# EAGLE design MAX-M8Q GPS FeatherWing (EAGLE 8.3.2)
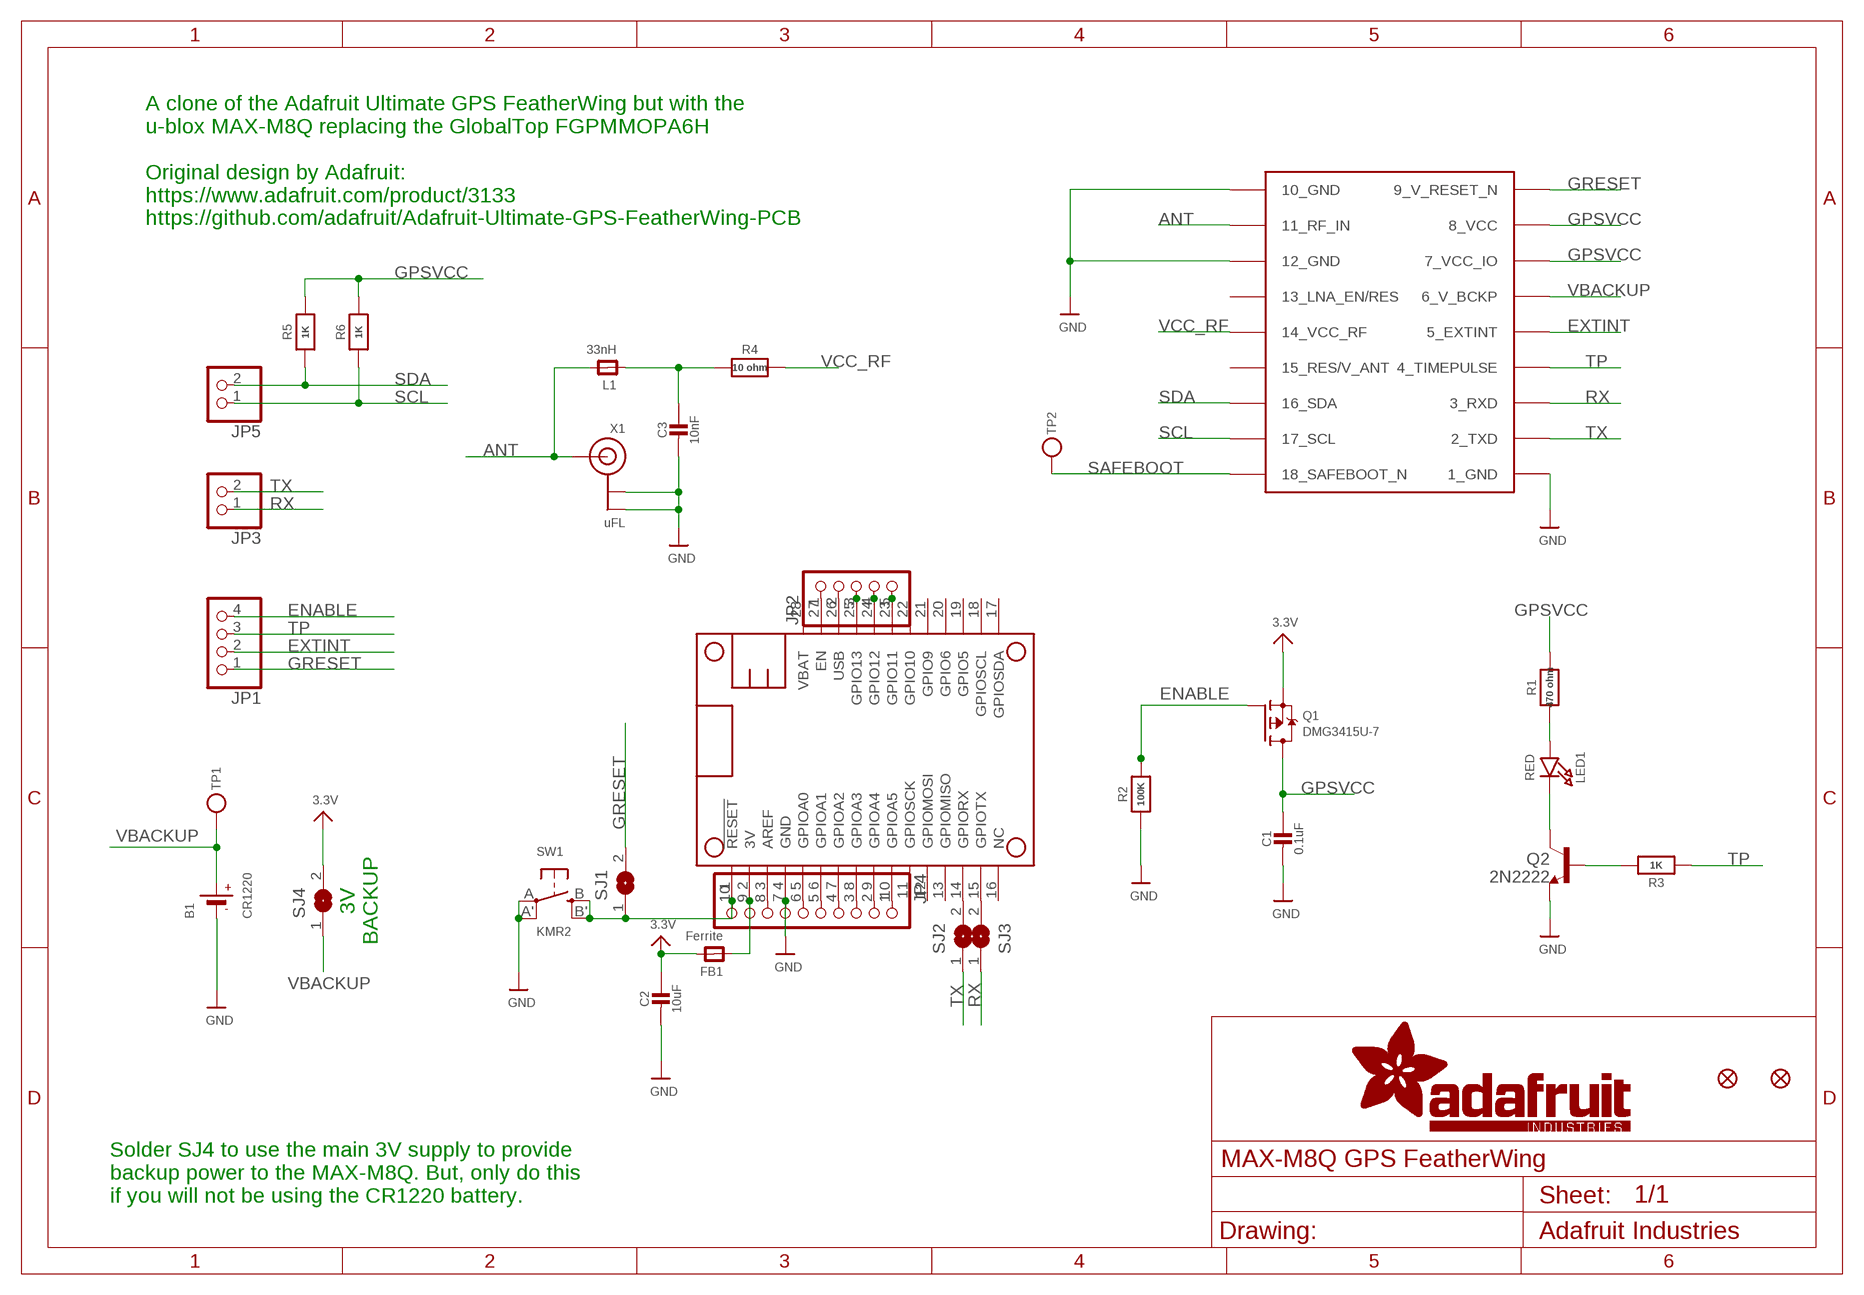
[diagram p0: schematic, sheet 1]

## Parts
B1  CR1220  BATTERYCR1220_2  [CR1220-2]
C1  0.1uF  CAP_CERAMIC0805-NOOUTLINE  [0805-NO]
C2  10uF  CAP_CERAMIC0805-NOOUTLINE  [0805-NO]
C3  10nF  CAP_CERAMIC0805-NOOUTLINE  [0805-NO]
FB1  Ferrite  FERRITE-0805NO  [0805-NO]
FID1  FIDUCIAL""  [FIDUCIAL_1MM]
FID2  FIDUCIAL""  [FIDUCIAL_1MM]
JP1  HEADER-1X4ROUND  [1X04_ROUND]
JP2  HEADER-1X570MIL  [1X05_ROUND_70]
JP3  HEADER-1X2ROUND  [1X02_ROUND]
JP4  HEADER-1X10ROUND  [1X10_ROUND]
JP5  HEADER-1X2ROUND  [1X02_ROUND]
L1  33nH  FERRITE-0805NO  [0805-NO]
LED1  RED  LED0805_NOOUTLINE  [CHIPLED_0805_NOOUTLINE]
MS1  FEATHERWING  [FEATHERWING]
Q1  DMG3415U-7  MOSFET-PWIDE  [SOT23-WIDE]
Q2  2N2222  MMBT2222ALT1-NPN-SOT23-BEC  [SOT23-BEC]
R1  470 ohm  RESISTOR0805_NOOUTLINE  [0805-NO]
R2  100K  RESISTOR0805_NOOUTLINE  [0805-NO]
R3  1K  RESISTOR0805_NOOUTLINE  [0805-NO]
R4  10 ohm  RESISTOR0805_NOOUTLINE  [0805-NO]
R5  1K  RESISTOR0805_NOOUTLINE  [0805-NO]
R6  1K  RESISTOR0805_NOOUTLINE  [0805-NO]
SJ1  SOLDERJUMPER  [SOLDERJUMPER_ARROW_NOPASTE]
SJ2  SOLDERJUMPERCLOSED  [SOLDERJUMPER_CLOSEDWIRE]
SJ3  SOLDERJUMPERCLOSED  [SOLDERJUMPER_CLOSEDWIRE]
SJ4  SOLDERJUMPER  [SOLDERJUMPER_ARROW_NOPASTE]
SW1  KMR2  SWITCH_TACT_SMT4.6X2.8  [BTN_KMR2_4.6X2.8]
TP1  TESTPOINTROUND1.5MM  [TESTPOINT_ROUND_1.5MM]
TP2  TESTPOINTROUND1.5MM  [TESTPOINT_ROUND_1.5MM]
U1  MAX-M8  [MAX-M8]
X1  uFL  ANTENNA_U.FL  [U.FL]

## Nets
3.3V: C2.1 FB1.2 Q1.2(S) SJ4.2
3V: FB1.1 JP4.9 MS1.2(3V)
ANT: L1.2 U1.11_RF_IN X1.3(SIGNAL)
ENABLE: JP1.4 Q1.1(G) R2.2
EXTINT: JP1.2 U1.5_EXTINT
GND: B1.- C1.2 C2.2 C3.2 JP4.7 MS1.4(GND) Q2.E R2.1 SW1.A'(P1) SW1.A(P) U1.1_GND U1.10_GND U1.12_GND X1.1(GND) X1.2(GND)
GPSVCC: C1.1 Q1.3(D) R1.2 R5.2 R6.2 U1.7_VCC_IO U1.8_VCC
GRESET: JP1.1 SJ1.2 U1.9_RESET_N(9_V_RESET_N)
N$1: JP2.3 MS1.25(GPIO13)
N$2: LED1.A R1.1
N$3: JP2.4 MS1.24(GPIO12)
N$4: C3.1 L1.1 R4.1
N$5: JP2.5 MS1.23(GPIO11)
N$6: JP4.1 MS1.10(GPIOA5)
N$7: JP4.2 MS1.9(GPIOA4)
N$8: JP4.3 MS1.8(GPIOA3)
N$9: JP4.4 MS1.7(GPIOA2)
N$10: JP4.5 MS1.6(GPIOA1)
N$11: JP4.6 MS1.5(GPIOA0)
N$12: JP4.10 MS1.1(!RESET) SJ1.1 SW1.B'(S1) SW1.B(S)
N$13: JP4.8 MS1.3(AREF)
N$14: JP2.1 MS1.27(EN)
N$16: MS1.14(GPIORX) SJ2.2
N$17: MS1.15(GPIOTX) SJ3.2
N$18: LED1.C Q2.C
N$19: Q2.B R3.2
RX: JP3.1 SJ3.1 U1.3_RXD
SAFEBOOT: TP2.P$1 U1.18_SAFEBOOT_N
SCL: JP5.1 R6.1 U1.17_SCL
SDA: JP5.2 R5.1 U1.16_SDA
TP: JP1.3 R3.1 U1.4_TIMEPULSE
TX: JP3.2 SJ2.1 U1.2_TXD
USB: JP2.2 MS1.26(USB)
VBACKUP: B1.+ SJ4.1 TP1.P$1 U1.6_V_BCKP
VCC_RF: R4.2 U1.14_VCC_RF
Unconnected: MS1.11(GPIOSCK) MS1.12(GPIOMOSI) MS1.13(GPIOMISO) MS1.16(NC) MS1.17(GPIOSDA) MS1.18(GPIOSCL) MS1.19(GPIO5) MS1.20(GPIO6) MS1.21(GPIO9) MS1.22(GPIO10) MS1.28(VBAT) U1.13_LNA_EN(13_LNA_EN/RES) U1.15_V_ANT/RESERVED(15_RES/V_ANT)

## Notes on the sheet
- A clone of the Adafruit Ultimate GPS FeatherWing but with the
  u-blox MAX-M8Q replacing the GlobalTop FGPMMOPA6H
  
  Original design by Adafruit:
  https://www.adafruit.com/product/3133
  https://github.com/adafruit/Adafruit-Ultimate-GPS-FeatherWing-PCB
- 3V
  BACKUP
- Solder SJ4 to use the main 3V supply to provide
  backup power to the MAX-M8Q. But, only do this
  if you will not be using the CR1220 battery.

## Library data of the parts
B1 = microbuilder:BATTERY: CR1220 SMT - Digikey: 3001K-ND CD2032 BAT-HLD-001 - Digikey: BAT-HLD-001-ND
C1-C3 = microbuilder:CAP_CERAMIC: Ceramic Capacitors For new designs, use the packages preceded by an '_' character since they are more reliable: The following footprints should be used on most boards: _0402 - Standard footprint for regular board layouts _0603 - Standard footprint for regular board layouts _0805 - Standard footprint for regular board layouts _1206 - Standard footprint for regular board layouts For extremely tight-pitch boards where space is at a premium, the following 'micro-pitch' footprints can be used (smaller pads, no silkscreen outline, etc.): _0402MP - Micro-pitch footprint for very dense/compact boards _0603MP - Micro-pitch footprint for very dense/compact boards _0805MP - Micro-pitch footprint for very dense/compact boards _1206MP - Micro-pitch footprint for very dense/compact boards
FB1 L1 = microbuilder:FERRITE: Ferrite Bead 0603 MMZ1608B121C - 120 Ohm @ 100MHz, 600mA, 0.15 Ohm DC Resistance - Digikey: 445-2164-1-ND BK1608HW121-T - 120 Ohm, 600mA Ferrite Chip - Digikey: 587-1876-2-ND 0805 HZ0805B272R-10 - 2.7K Ohm @ 100MHz, 200mA, 0.8 Ohm DC Resistance - Digikey: 240-2504-1-ND (see also Murata BLM21BD272SN1L) MMZ2012Y152B - 1.5K Ohm @ 100MHz, 500mA, 0.4 Ohm DC Resistance - Digikey: 445-1560-1-ND - Mainly for high frequency (80-400MHz) MMZ2012R102A - 1K Ohm @ 100MHz, 500mA, 0.3 Ohm DC Resistance - Digikey: 445-1555-2-ND - More general purpose (10-200MHz)
FID1 FID2 = microbuilder:FIDUCIAL: Fiducial Alignment Points Various fiducial points for machine vision alignment.; BOM: EXCLUDE
JP1 = microbuilder:HEADER-1X4: PIN HEADER
JP2 = microbuilder:HEADER-1X5: PIN HEADER
JP3 JP5 = microbuilder:HEADER-1X2: PIN HEADER
JP4 = microbuilder:HEADER-1X10: PIN HEADER
LED1 = microbuilder:LED: LED 0603 - 0603 Surface Mount Package 2mA: Green LED - Low Power (3.9mcd, 2ma, 1.7Vf) - Digikey: 475-2709-2-ND Orange LED - Low Power (9.8mcd, 2ma, 1.8Vf) - Digikey: 475-1194-2-ND Red LED - Low Power (5mcd, 2ma, 1.8Vf) - Digikey: 475-1195-2-ND Yellow LED - Low Power (7mcd, 2ma, 1.8Vf) - Digikey: 475-1196-2-ND 5mA: Blue LED - Low Power (17mcd, 5ma, 2.9Vf) - Digikey: LNJ937W8CRACT-ND 0805 - 0805 Surface Mount Package 2mA: Red LED (8.8mcd, 2mA, 1.8Vf, Clear) - Low Power [Digikey: 475-2510-1-ND] Green LED (5mcd, 2mA, 1.8Vf, Clear) - Low Power [Digikey: 475-2730-1-ND] Yellow LED (11.3mcd, 2mA, 1.8Vf, Clear) - Low Power [Digikey: 475-2555-1-ND] 20mA: Red LED (104mcd, 20mA, Diffused) - LS R976 [Digikey: 475-1278-6-ND] Red LED (12mcd, 20mA, 2.0Vf, Clear) - APT2012EC [Digikey: 754-1128-1-ND] Green LED (15mcd, 20mA, 2.2Vf, Clear) - APT2012GC [Digikey: 754-1131-1-ND] Orange LED (160mcd, 20mA, 2.1Vf, Clear) - APT2012SECK [Digikey: 754-1130-1-ND] 1206 - 1206 Surface Mount Package Green LED (26mcd, 20mA, Diffused) - LG N971 [Digikey: 475-1407-6-ND] Red LED (15mcd, 20mA, Diffused) - LH N974 [Digikey: 475-1416-6-ND] Cree - Cree High-Power Surface Mount LEDs XPEBWT-L1-0000-00D50 - White 111lm 350mA 2.9Vf 6200K 110° XTEAWT-00-0000-00000LEE3 - White 114lm 350mA 2.85Vf 5000K 115° Everlight - Everlight 45-21 Series Surface Mount LEDs 45-21/QK2C-B2832AC2CB2/2T - Warm White 2000mcd 20mA 3.25Vf 3050K 120° 45-21/LK2C-B38452C4CB2/2T - Nuetral White 2000mcd 20mA 3.25Vf 4150K 120° 45-21/LK2C-B50634C6CB2/2T - Cold White 2200mcd 20mA 3.25Vf 5650K 120° PLCC2 Reverse Mount LS T77K-J1L2-1-0-2-R18-Z - Red 11.25mcd 2mA 1.8Vf 630nm 120° LO T77K-L1M2-24-Z - Orange 19.6mcd 2mA 1.8Vf 606nm 120° LY T77K-K2M1-26-Z - Yellow 15.7mcd 2mA 1.8Vf 587nm 120°
MS1 = microbuilder:FEATHERWING
Q1 = microbuilder:MOSFET-P: P-Channel Mosfet LEGEND VDS: Voltage Drain-Source ID: Drain Current RDS(ON): Drain-Source On-State Resistance VGS(TH): Gate-Source Threshold Voltage CISS: Drain-Source Input Capacitance SOT-23 Name VDS ID RDS(ON) VGS(TH) CISS Order Number IRLML5103 30V 760mA 600 mOhm -- 75pF @ 25V Digikey: IRLML5103PBFCT-ND IRLML6401 12V 4.3A 50 mOhm 950mV @ 250µA 830pF @ 10V Digikey: IRLML6401PBFTR-ND NTR0202PL 20V 400mA 800 mOhm 2.3V @ 250uA 70pF @ 5V Digikey: NTR0202PLT1GOSTR-ND NTR4101PT1G 20V 1.8A 85 mOhm 1.2V @ 250uA 675pF @ 10V Digikey: NTR4101PT1GOSCT-ND DMP2004K 20V 600mA 900 mOhm 1V @ 250uA 175pF @ 16V Digikey: DMP2004KDICT-ND PMV65XP 20V 3.9A 76 mOhm 950mV @ 1mA 725pF @ 20V Digikey: 568-2358-2-ND TO-252 Name VDS ID RDS(ON) VGS(TH) CISS Order Number AOD417 30V 25A 34 mOhm 3V @ 250µA 920pF @ 15V Digikey: 785-1106-2-ND
Q2 = transistor:*-NPN-: NPN Transistror BF959 corrected 2008.03.06
R1-R6 = microbuilder:RESISTOR: Resistors For new designs, use the packages preceded by an '_' character since they are more reliable: The following footprints should be used on most boards: _0402 - Standard footprint for regular board layouts _0603 - Standard footprint for regular board layouts _0805 - Standard footprint for regular board layouts _1206 - Standard footprint for regular board layouts For extremely tight-pitch boards where space is at a premium, the following 'micro-pitch' footprints can be used (smaller pads, no silkscreen outline, etc.): _0402MP - Micro-pitch footprint for very dense/compact boards _0603MP - Micro-pitch footprint for very dense/compact boards _0805MP - Micro-pitch footprint for very dense/compact boards _1206MP - Micro-pitch footprint for very dense/compact boards
SJ1 SJ4 = microbuilder:SOLDERJUMPER: SMD Solder JUMPER Solder the two pads together to create a connection, or remove the solder to break it. REFLOW - Use this footprint for solder paste and reflow ovens. WAVE - Use this footprint for hand-soldering (larger pads). CLOSED - Has a trace between the two pads to ensure it is closed by default. The trace needs to be cut to disable the jumper, and can be closed again by creating a solder bridge between the two pads.; BOM: EXCLUDE
SJ2 SJ3 = microbuilder:SOLDERJUMPER: SMD Solder JUMPER Solder the two pads together to create a connection, or remove the solder to break it. REFLOW - Use this footprint for solder paste and reflow ovens. WAVE - Use this footprint for hand-soldering (larger pads). CLOSED - Has a trace between the two pads to ensure it is closed by default. The trace needs to be cut to disable the jumper, and can be closed again by creating a solder bridge between the two pads.
SW1 = microbuilder:SWITCH_TACT_SMT: SMT Tact Switches 6x6mm - Digikey: P12940SCT-ND KMR2 (4.6x2.8mm) - Digikey: 401-1426-1-ND EVQ-PQHB55 - Light Touch, 160GF (4.5x4.5mm) - Digikey: P8090SCT-ND KMT0 - KMT021 NGJ LHS (etc.) IP68/Waterproof - Digikey: CKN10289CT-ND
TP1 TP2 = microbuilder:TESTPOINT: Test Point Various test points for characterisation and PCB testing TESTPOINT_SMT - Compact Surface Mount Test Point [Digikey: 5016KTR-ND]
U1 = ubloxLib:MAX-M8: u-blox MAX GNSS module
X1 = microbuilder:ANTENNA_U.FL: U.FL Antenna Connector

## Board
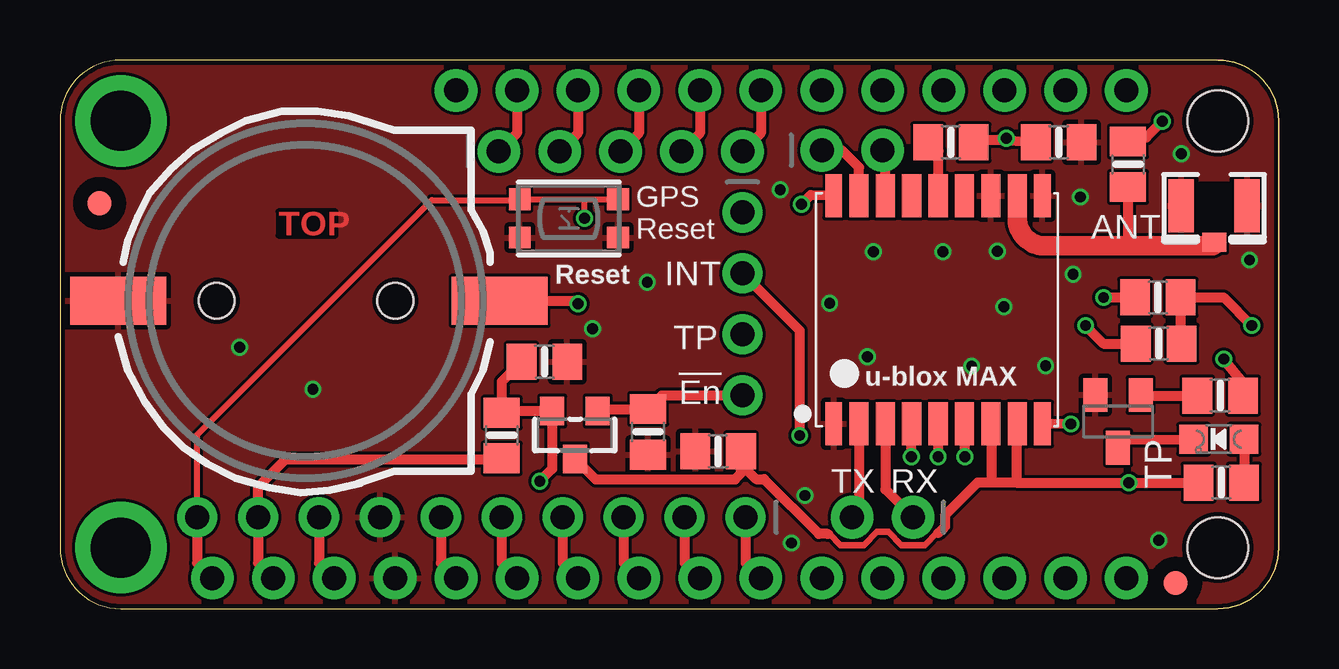
[diagram p1: board, top side]
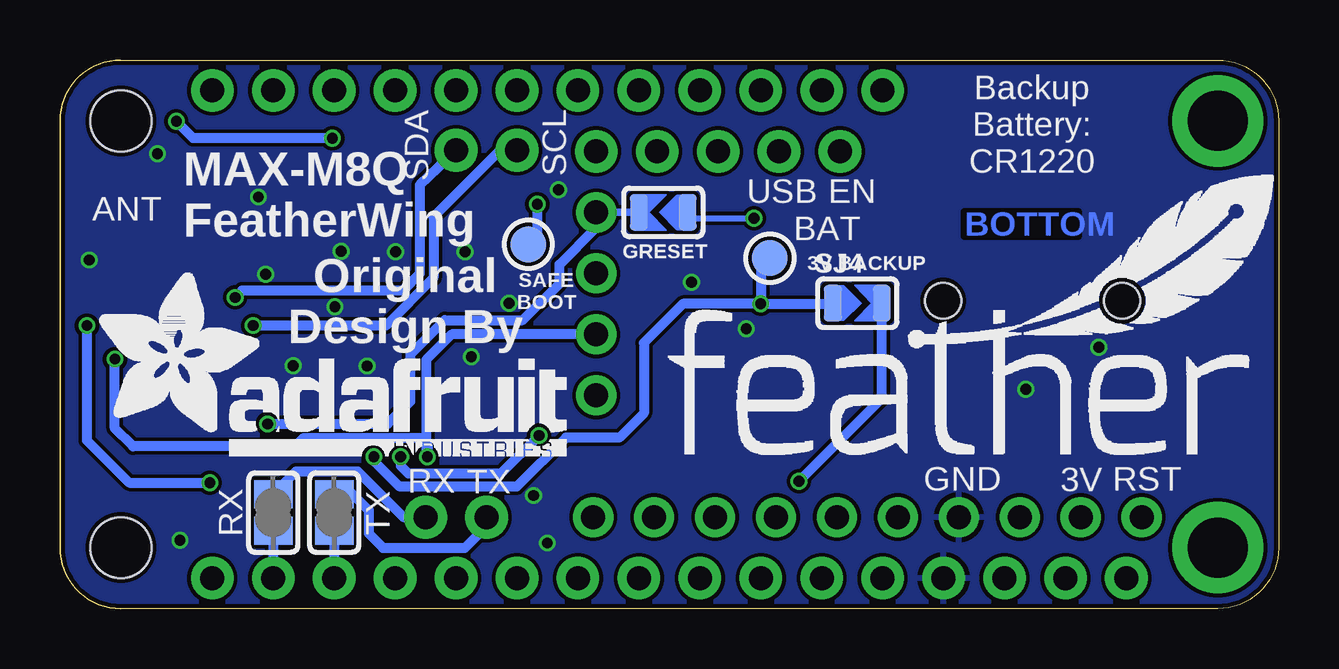
[diagram p2: board, bottom side, seen from below]

Size 50.8 x 22.86 mm. Coordinates in mm from the lower left corner, seen from the top.
Outline: 48.26,22.86 arc-90 50.8,20.32 50.8,2.54 arc-90 48.26,0
Copper layers (1*16): Top 0.018mm / dielectric 1.55mm / Bottom 0.018mm
Design rules "Multi-CB_2L_125um-Tracks_OL35um *": minimum track width 0.125mm, minimum drill 0.2mm, track to track 0.125mm, track to pad 0.125mm, pad to pad 0.125mm, via to via 0.125mm, smd to smd 0mil, copper to edge 0.2mm, drill to drill 0.2mm, minimum pad ring 0.125mm, minimum via ring 0.125mm, stop-mask expansion 2mil, vias tented up to drill 0.45mm, thermal gap 0.2mm

### Footprints (pad centres in the part's own frame; a part is rotated, then mirrored left to right if it is on the bottom)
CR1220-2 = smd 4 x 2: + 8.29,0; - -7.6,0 | hole 1.5: 3.95,0; -3.5,0
0805-NO = smd 1.24 x 1.5: 1 -0.95,0; 2 0.95,0
FIDUCIAL_1MM = smd 1 x 1: 1 0,0
1X04_ROUND = drill 1 pad 1.676: 1 -3.81,0; 2 -1.27,0; 3 1.27,0; 4 3.81,0
1X05_ROUND_70 = drill 1 pad 1.778: 1 -5.08,0; 2 -2.54,0; 3 0,0; 4 2.54,0; 5 5.08,0
1X02_ROUND = drill 1 pad 1.778: 1 -1.27,0; 2 1.27,0
1X10_ROUND = drill 1 pad 1.676: 1 -11.43,0; 2 -8.89,0; 3 -6.35,0; 4 -3.81,0; 5 -1.27,0; 6 1.27,0; 7 3.81,0; 8 6.35,0; 9 8.89,0; 10 11.43,0
CHIPLED_0805_NOOUTLINE = smd 1.2 x 1.2: A 0,-1.05; C 0,1.05
FEATHERWING = drill 1 pad 1.778: 1 6.35,1.27; 2 8.89,1.27; 3 11.43,1.27; 4 13.97,1.27; 5 16.51,1.27; 6 19.05,1.27; 7 21.59,1.27; 8 24.13,1.27; 9 26.67,1.27; 10 29.21,1.27; 11 31.75,1.27; 12 34.29,1.27; 13 36.83,1.27; 14 39.37,1.27; 15 41.91,1.27; 16 44.45,1.27; 17 44.45,21.59; 18 41.91,21.59; 19 39.37,21.59; 20 36.83,21.59; 21 34.29,21.59; 22 31.75,21.59; 23 29.21,21.59; 24 26.67,21.59; 25 24.13,21.59; 26 21.59,21.59; 27 19.05,21.59; 28 16.51,21.59 | drill 2.5 pad 3.81: P$1 2.54,20.32; P$2 2.54,2.54 | hole 2.54: 48.26,20.32; 48.26,2.54
SOT23-WIDE = smd 1 x 1.2: 1 -0.95,-1; 2 0.95,-1; 3 0,1
SOT23-BEC = smd 1 x 1.4: B -0.95,-1.1; C 0,1.1; E 0.95,-1.1
SOLDERJUMPER_ARROW_NOPASTE = smd 0.762 x 1.524: 1 -1.016,0; 2 1.016,0
SOLDERJUMPER_CLOSEDWIRE = smd 1.168 x 1.6: 1 -0.762,0; 2 0.762,0 | smd 0.635 x 0.203: WIRE 0,0
BTN_KMR2_4.6X2.8 = smd 0.9 x 0.9: A 2.05,0.8; A' -2.05,0.8; B 2.05,-0.8; B' -2.05,-0.8
TESTPOINT_ROUND_1.5MM = smd 1.5 x 1.5: P$1 0,0
MAX-M8 = smd 1.8 x 0.7: 1_GND 4.95,-4.4; 9_RESET_N 4.95,4.3; 10_GND -4.55,4.3; 18_SAFEBOOT_N -4.55,-4.4 | smd 1.8 x 0.8: 2_TXD 4.95,-3.35; 3_RXD 4.95,-2.25; 4_TIMEPULSE 4.95,-1.15; 5_EXTINT 4.95,-0.05; 6_V_BCKP 4.95,1.05; 7_VCC_IO 4.95,2.15; 8_VCC 4.95,3.25; 11_RF_IN -4.55,3.25; 12_GND -4.55,2.15; 13_LNA_EN -4.55,1.05; 14_VCC_RF -4.55,-0.05; 15_V_ANT/RESERVED -4.55,-1.15; 16_SDA -4.55,-2.25; 17_SCL -4.55,-3.35
U.FL = smd 2.2 x 1.05: 1 0,1.375; 2 0,-1.375 | smd 0.8 x 1: 3 1.525,0

### Placement (x,y rotation side)
B1  10.03,12.83 0 top
C1  27.43,6.55 180 top
C2  20.19,10.29 0 top
C3  41.63,19.43 0 top
FB1  18.41,7.21 90 top
FID1  1.65,16.89 0 top
FID2  46.51,1.06 0 top
JP1  28.45,12.7 270 top
JP2  23.37,19.05 0 top
JP3  34.29,3.81 180 top
JP4  17.14,3.81 180 top
JP5  33.02,19.1 0 top
L1  44.52,18.52 270 top
LED1  48.3,7.06 90 top
MS1  0,0 0 top
Q1  21.46,7.24 180 top
Q2  44.1,7.8 180 top
R1  48.4,5.25 180 top
R2  24.51,7.37 90 top
R3  48.36,8.88 180 top
R4  37.13,19.43 180 top
R5  45.76,12.97 0 top
R6  45.8,11.04 0 top
SJ1  25.65,16.51 180 bottom
SJ2  39.37,4 270 bottom
SJ3  41.91,4 270 bottom
SJ4  17.56,12.73 0 bottom
SW1  21.21,16.26 180 top
TP1  21.21,14.61 0 bottom
TP2  31.28,15.18 0 bottom
U1  36.65,12.65 270 top
X1  48.11,16.79 270 top

### Tracks (layer width: path | path; a pad name or v marks a point on that pad's centre or on a via)
3.3V  (via drill 0.45)
  Top 0.406: C2.1 18.41,9.46 FB1.2 18.49,8.24 Q1.2 20.51,5.83 v20,5.31
  Bottom 0.406: v20,5.31 16.55,8.76 SJ4.2
3V
  Top 0.406: MS1.2 8.26,1.91 JP4.9 8.26,5.08 9.4,6.22 18.37,6.22 FB1.1
ANT
  Top 0.406: L1.2 44.52,15.13 44.54,15.11
  Top 0.813: U1.11_RF_IN 39.9,16.33 arc90 41,15.11 44.54,15.11 48.03,15.11 arc90 X1.3
ENABLE
  Top 0.406: Q1.1 22.49,8.32 R2.2 25.09,8.89 JP1.4
EXTINT  (via drill 0.45)
  Top 0.406: U1.5_EXTINT 36.6,7.72 v36.6,6.33 | v30.84,7.21 30.84,11.58 JP1.2
  Bottom 0.406: v36.6,6.33 36.6,5.94 36.29,5.63 32.42,5.63 v30.84,7.21
GND  (via drill 0.45)
  other vias: 7.49,10.9 10.54,9.14 45.8,2.84 30.02,17.46 33.91,14.87 36.8,14.88 39.08,14.89 39.34,12.57 32.08,12.73 33.66,10.49 38,10.11 41.08,10.12 42.53,17.15 30.49,2.74 49.58,14.53 24.48,13.6 22.2,11.66 31.06,4.71 46.74,18.95 42.23,13.93
  pour Top (isolate 0.102): 0,22.86 0,0 50.8,0 50.8,22.86
  pour Bottom (isolate 0.152): 0,22.86 0,0 50.8,0 50.8,22.86
GPSVCC  (via drill 0.45)
  Top 0.279: 36.58,3.18 36.04,2.64 35.08,2.64 34.52,3.2 34.06,3.2 33.5,2.64 32.54,2.64 32.07,3.11
  Top 0.305: 36.61,3.14 36.58,3.18 | 32.07,3.11 31.99,3.11
  Top 0.406: Q1.3 22.33,5.39 28.14,5.39 28.38,5.65 28.38,5.75 | 28.38,5.75 C1.1 28.38,5.81 | 38.8,6.92 U1.7_VCC_IO 38.82,7.71 38.82,5.25 | 38.82,5.25 38.25,5.25 36.9,3.9 36.9,3.42 36.78,3.31 36.61,3.14 | 39.86,5.25 38.82,5.25 | 39.86,5.25 v44.55,5.25 R1.2 | U1.8_VCC 39.86,7.68 39.86,5.25 | R6.2 46.71,11.08 R5.2 48.5,12.97 v49.68,11.79 | 28.38,5.75 28.66,5.75 29.02,5.39 29.35,5.39 31.63,3.11 31.99,3.11
  Bottom 0.406: v49.68,11.79 49.68,7.01 47.91,5.25 v44.55,5.25
GRESET  (via drill 0.45)
  Top 0.406: U1.9_RESET_N 42.11,7.72 v42.14,7.7
  Bottom 0.305: JP1.1 SJ1.2
  Bottom 0.406: v42.14,7.7 37.13,7.7 36.2,8.64 36.2,10.59 34.77,12.02 31.51,12.02 29.99,13.55 29.99,14.33 28.45,15.87 JP1.1
N$1
  Top 0.406: MS1.25 24.13,19.81 JP2.3
N$2
  Top 0.406: LED1.A 49.37,6.18 R1.1
N$3
  Top 0.406: MS1.24 26.67,19.81 JP2.4
N$4  (via drill 0.45)
  Top 0.406: R4.1 38.1,19.52 39.36,19.52 | 39.36,19.52 v39.45,19.61 | v45.95,20.3 45.28,19.64 L1.1 | C3.1 39.38,19.5 39.36,19.52
  Bottom 0.406: v39.45,19.61 45.25,19.61 v45.95,20.3
N$5
  Top 0.406: MS1.23 29.21,19.81 JP2.5
N$6
  Top 0.406: JP4.1 28.57,1.91 MS1.10
N$7
  Top 0.406: JP4.2 26.04,1.91 MS1.9
N$8
  Top 0.406: JP4.3 23.5,1.91 MS1.8
N$9
  Top 0.406: JP4.4 20.95,1.91 MS1.7
N$10
  Top 0.406: JP4.5 18.41,1.91 MS1.6
N$11
  Top 0.406: JP4.6 15.88,1.91 MS1.5
N$12  (via drill 0.45)
  Top 0.254: JP4.10 5.71,7.24 15.49,17.02 19.12,17.02 SW1.B 21.87,17.06 | 21.87,17.06 SW1.B' | v21.87,16.27 21.87,17.06
  Top 0.406: JP4.10 5.71,1.91 MS1.1
  Bottom 0.254: SJ1.1 24.4,16.27 v21.87,16.27
N$13
  Top 0.406: JP4.8 10.79,1.91 MS1.3
N$14
  Top 0.406: MS1.27 19.05,19.81 JP2.1
N$16
  Bottom 0.406: SJ2.2 MS1.14
N$17
  Bottom 0.406: SJ3.2 MS1.15
N$18
  Top 0.406: Q2.C 44.57,7.04 LED1.C
N$19
  Top 0.406: Q2.B 45.08,8.88 R3.2
RX
  Top 0.406: U1.3_RXD 34.4,4.97 JP3.1
  Bottom 0.406: SJ3.1 40.96,5.71 38.39,5.71 36.48,3.81 JP3.1
SAFEBOOT  (via drill 0.45)
  Top 0.406: U1.18_SAFEBOOT_N 31.28,17.23 v30.91,16.85
  Bottom 0.406: v30.91,16.85 30.91,15.42 TP2.P$1
SCL  (via drill 0.45)
  Top 0.406: U1.17_SCL 33.3,18.39 32.6,19.09 JP5.1 | v42.75,11.79 43.5,11.04 R6.1
  Bottom 0.406: JP5.1 32.46,19.09 35.23,16.32 35.23,13.78 37.22,11.79 v42.75,11.79
SDA  (via drill 0.45)
  Top 0.406: U1.16_SDA 34.4,19.01 JP5.2 | v43.5,12.97 R5.1 | R5.1
  Bottom 0.406: JP5.2 35.81,17.66 35.81,13.96 36.51,13.26 43.21,13.26 v43.5,12.97
TP  (via drill 0.45)
  Top 0.406: R3.1 49.3,9.44 v48.51,10.4 | v35.48,6.33 35.48,7.71 U1.4_TIMEPULSE
  Bottom 0.406: 35.56,6.4 v35.48,6.33 | JP1.3 34.47,11.43 35.53,10.36 35.53,6.38 v35.48,6.33 | v35.48,6.33 35.48,6.83 35.76,7.11 40.64,7.11 41,6.76 47.75,6.76 48.51,7.51 v48.51,10.4
TX
  Top 0.406: U1.2_TXD 33.3,4.09 JP3.2
  Bottom 0.406: SJ2.1 38.72,4.88 37.93,4.1 37.93,3.13 37.34,2.54 33.92,2.54 33.02,3.43 JP3.2
USB
  Top 0.406: MS1.26 21.59,19.81 JP2.2
VBACKUP  (via drill 0.45)
  Top 0.406: B1.+ 21.46,12.83 v21.59,12.7 | U1.6_V_BCKP 37.7,6.34 v37.72,6.33
  Bottom 0.406: TP1.P$1 21.59,14.22 v21.59,12.7 | v21.59,12.7 24.84,12.7 26.46,11.08 26.46,8.15 27.48,7.13 29.71,7.13 31.76,5.08 36.64,5.08 37.72,6.17 v37.72,6.33 | v21.59,12.7 18.61,12.7 SJ4.1
VCC_RF
  Top 0.406: U1.14_VCC_RF 36.62,17.24 36.62,19.07 R4.2

### Text on the board
Top: TOP
Bottom: BOTTOM
tPlace: GPS / Reset | ANT | Reset | INT | TP | !En | TX | RX | TP
bPlace: Backup / Battery: / CR1220 | SCL | SDA | MAX-M8Q / FeatherWing | EN | USB | ANT | BAT | GRESET | 3V BACKUP | SAFE / BOOT | Original / Design By | RST | 3V | GND | TX | RX | TX | RX
tDocu: L1 | R4 | X1 | B1 | SW1 | U1 | C2 | R2 | R3 | Q2 | FB1 | LED1 | Q1 | JP3 | R1 | C1